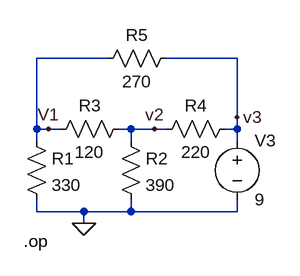
[diagram p0: schematic mesh1.asc]
mesh1.asc, the LTspice schematic file:
Version 4
SHEET 1 880 680
WIRE 144 48 48 48
WIRE 320 48 224 48
WIRE 320 128 320 48
WIRE 48 144 48 48
WIRE 64 144 48 144
WIRE 80 144 64 144
WIRE 176 144 160 144
WIRE 208 144 176 144
WIRE 224 144 208 144
WIRE 320 144 320 128
WIRE 320 144 304 144
WIRE 48 160 48 144
WIRE 176 160 176 144
WIRE 320 160 320 144
WIRE 48 256 48 240
WIRE 112 256 48 256
WIRE 176 256 176 240
WIRE 176 256 112 256
WIRE 320 256 320 240
WIRE 320 256 176 256
WIRE 112 272 112 256
FLAG 112 272 0
FLAG 64 144 V1
FLAG 208 144 v2
FLAG 320 128 v3
DATAFLAG 48 128 ""
DATAFLAG 192 144 ""
DATAFLAG 320 128 ""
SYMBOL res 32 144 R0
SYMATTR InstName R1
SYMATTR Value 330
SYMBOL res 160 144 R0
SYMATTR InstName R2
SYMATTR Value 390
SYMBOL res 176 128 R90
WINDOW 0 0 56 VBottom 2
WINDOW 3 32 56 VTop 2
SYMATTR InstName R3
SYMATTR Value 120
SYMBOL res 320 128 R90
WINDOW 0 0 56 VBottom 2
WINDOW 3 32 56 VTop 2
SYMATTR InstName R4
SYMATTR Value 220
SYMBOL res 240 32 R90
WINDOW 0 0 56 VBottom 2
WINDOW 3 32 56 VTop 2
SYMATTR InstName R5
SYMATTR Value 270
SYMBOL voltage 320 144 R0
WINDOW 123 0 0 Left 0
WINDOW 39 0 0 Left 0
SYMATTR InstName V3
SYMATTR Value 9
TEXT 30 296 Left 2 !.op

The netlist it stands for:
* mesh1.asc
R1 V1 0 330
R2 v2 0 390
R3 v2 V1 120
R4 v3 v2 220
R5 v3 V1 270
V3 v3 0 9
.op
.backanno
.end